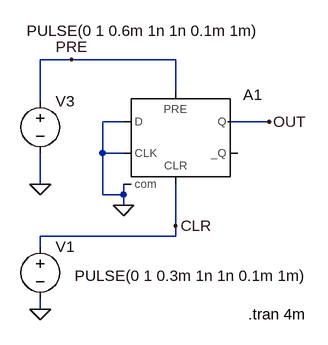
[diagram p0: schematic Fig_2-157_Logic_DFF-ClrPre.asc]
Fig_2-157_Logic_DFF-ClrPre.asc, the LTspice schematic file:
Version 4
SHEET 1 880 680
WIRE 80 48 32 48
WIRE 240 48 80 48
WIRE 240 96 240 48
WIRE 32 112 32 48
WIRE 160 144 128 144
WIRE 384 144 320 144
WIRE 128 192 128 144
WIRE 160 192 128 192
WIRE 32 240 32 192
WIRE 128 256 128 192
WIRE 160 256 160 240
WIRE 160 256 128 256
WIRE 160 272 160 256
WIRE 240 304 240 240
WIRE 240 320 240 304
WIRE 240 320 32 320
WIRE 32 336 32 320
WIRE 32 432 32 416
FLAG 384 144 OUT
FLAG 32 432 0
FLAG 160 272 0
FLAG 80 48 PRE
FLAG 240 304 CLR
FLAG 32 240 0
SYMBOL voltage 32 320 R0
WINDOW 3 53 61 Left 2
WINDOW 123 0 0 Left 2
WINDOW 39 0 0 Left 2
SYMATTR Value PULSE(0 1 0.3m 1n 1n 0.1m 1m)
SYMATTR InstName V1
SYMBOL voltage 32 96 R0
WINDOW 3 -21 -92 Left 2
WINDOW 123 0 0 Left 2
WINDOW 39 0 0 Left 2
SYMATTR Value PULSE(0 1 0.6m 1n 1n 0.1m 1m)
SYMATTR InstName V3
SYMBOL Digital\\dflop 240 96 R0
SYMATTR InstName A1
TEXT 352 440 Left 2 !.tran 4m

The netlist it stands for:
* Fig_2-157_Logic_DFF-ClrPre.asc
V1 CLR 0 PULSE(0 1 0.3m 1n 1n 0.1m 1m)
V3 PRE 0 PULSE(0 1 0.6m 1n 1n 0.1m 1m)
A1 0 0 0 PRE CLR 0 OUT 0 DFLOP
.tran 4m
.backanno
.end